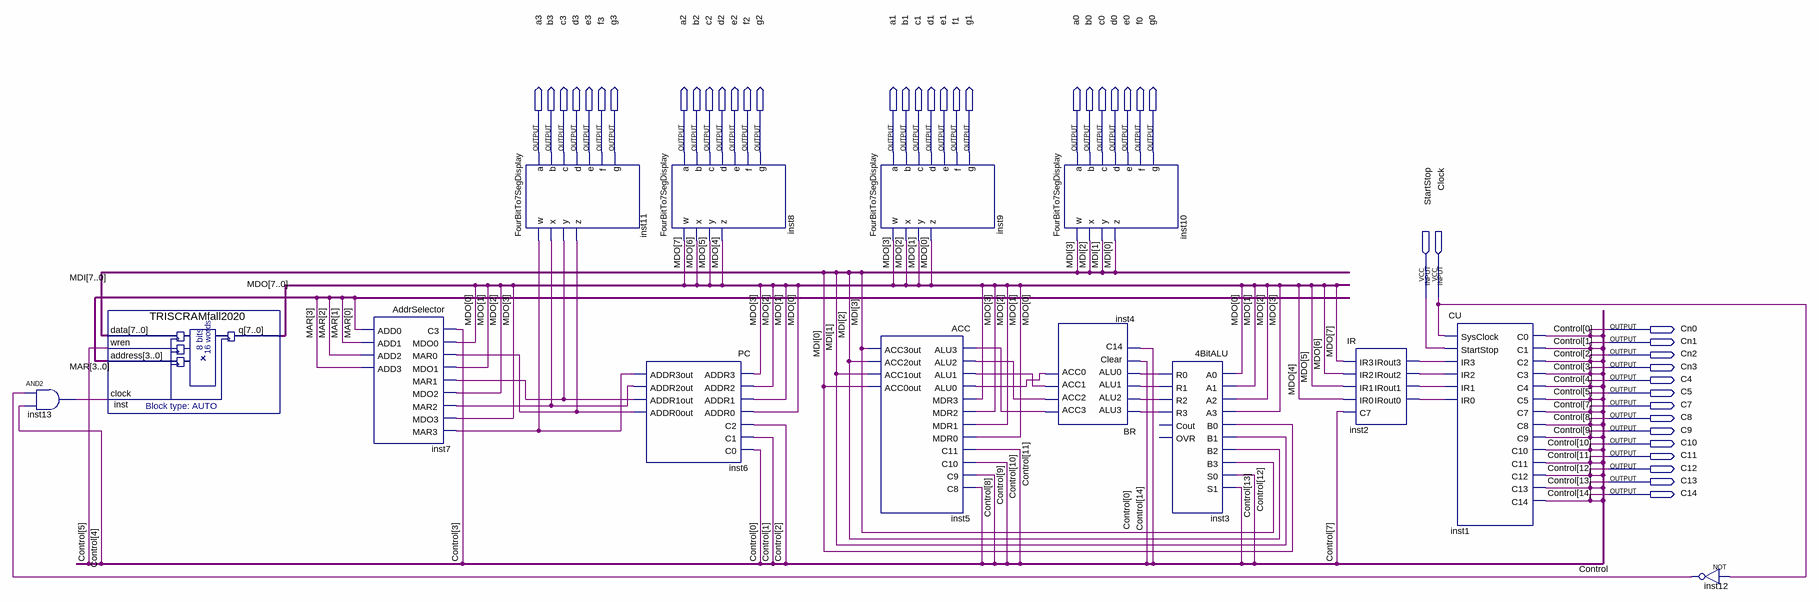
[diagram p0: schematic sheet]
// Quartus schematic CSE2441Project.bdf as structural Verilog: 14 symbols, 44 pins
module CSE2441Project (
  input  StartStop,
  input  Clock,
  output a3,
  output b3,
  output c3,
  output d3,
  output e3,
  output f3,
  output g3,
  output a2,
  output b2,
  output c2,
  output d2,
  output e2,
  output f2,
  output g2,
  output a1,
  output b1,
  output c1,
  output d1,
  output e1,
  output f1,
  output g1,
  output a0,
  output b0,
  output c0,
  output d0,
  output e0,
  output f0,
  output g0,
  output Cn0,
  output Cn1,
  output Cn2,
  output Cn3,
  output C4,
  output C5,
  output C7,
  output C8,
  output C9,
  output C10,
  output C11,
  output C12,
  output C13,
  output C14
);

  wire inst2_irout0, inst2_irout1, inst2_irout2, inst2_irout3, inst3_r0, inst3_r1, inst3_r2, inst3_r3,
       inst4_acc0, inst4_acc1, inst4_acc2, inst4_acc3, inst6_addr0out, inst6_addr1out, inst6_addr2out,
       inst6_addr3out, inst12_out, inst13_out;
  wire [3:0] MAR;
  wire [7:0] MDI, MDO;

  and inst13 (inst13_out, inst12_out, C4);
  TRISCRAMfall2020 inst (.data(MDI), .wren(C5), .address(MAR), .clock(inst13_out), .q(MDO));
  AddrSelector inst7 (
    .C3(Cn3), .MDO0(MDO[0]), .MAR0(inst6_addr0out), .MDO1(MDO[1]), .MAR1(inst6_addr1out), .MDO2(MDO[2]),
    .MAR2(inst6_addr2out), .MDO3(MDO[3]), .MAR3(inst6_addr3out), .ADD0(MAR[0]), .ADD1(MAR[1]), .ADD2(MAR[2]),
    .ADD3(MAR[3]));
  FourBitTo7SegDisplay inst11 (
    .w(inst6_addr3out), .x(inst6_addr2out), .y(inst6_addr1out), .z(inst6_addr0out), .a(a3), .b(b3), .c(c3),
    .d(d3), .e(e3), .f(f3), .g(g3));
  FourBitTo7SegDisplay inst8 (
    .w(MDO[7]), .x(MDO[6]), .y(MDO[5]), .z(MDO[4]), .a(a2), .b(b2), .c(c2), .d(d2), .e(e2), .f(f2), .g(g2));
  PC inst6 (
    .ADDR3(MDO[3]), .ADDR2(MDO[2]), .ADDR1(MDO[1]), .ADDR0(MDO[0]), .C2(Cn2), .C1(Cn1), .C0(Cn0),
    .ADDR3out(inst6_addr3out), .ADDR2out(inst6_addr2out), .ADDR1out(inst6_addr1out), .ADDR0out(inst6_addr0out));
  FourBitTo7SegDisplay inst9 (
    .w(MDO[3]), .x(MDO[2]), .y(MDO[1]), .z(MDO[0]), .a(a1), .b(b1), .c(c1), .d(d1), .e(e1), .f(f1), .g(g1));
  ACC inst5 (
    .ALU3(inst4_acc3), .ALU2(inst4_acc2), .ALU1(inst4_acc1), .ALU0(inst4_acc0), .MDR3(MDO[3]), .MDR2(MDO[2]),
    .MDR1(MDO[1]), .MDR0(MDO[0]), .C11(C11), .C10(C10), .C9(C9), .C8(C8), .ACC3out(MDI[3]), .ACC2out(MDI[2]),
    .ACC1out(MDI[1]), .ACC0out(MDI[0]));
  FourBitTo7SegDisplay inst10 (
    .w(MDI[3]), .x(MDI[2]), .y(MDI[1]), .z(MDI[0]), .a(a0), .b(b0), .c(c0), .d(d0), .e(e0), .f(f0), .g(g0));
  BR inst4 (
    .ALU3(inst3_r3), .ALU2(inst3_r2), .ALU1(inst3_r1), .ALU0(inst3_r0), .Clear(Cn0), .C14(C14),
    .ACC3(inst4_acc3), .ACC2(inst4_acc2), .ACC1(inst4_acc1), .ACC0(inst4_acc0));
  \4BitALU  inst3 (
    .A0(MDO[0]), .A1(MDO[1]), .A2(MDO[2]), .A3(MDO[3]), .B0(MDI[0]), .B1(MDI[1]), .B2(MDI[2]), .B3(MDI[3]),
    .S0(C12), .S1(C13), .R0(inst3_r0), .R1(inst3_r1), .R2(inst3_r2), .R3(inst3_r3));  // open: Cout, OVR
  IR inst2 (
    .IR3(MDO[7]), .IR2(MDO[6]), .IR1(MDO[5]), .IR0(MDO[4]), .C7(C7), .IRout3(inst2_irout3),
    .IRout2(inst2_irout2), .IRout1(inst2_irout1), .IRout0(inst2_irout0));
  CU inst1 (
    .SysClock(Clock), .StartStop(StartStop), .IR3(inst2_irout3), .IR2(inst2_irout2), .IR1(inst2_irout1),
    .IR0(inst2_irout0), .C0(Cn0), .C1(Cn1), .C2(Cn2), .C3(Cn3), .C4(C4), .C5(C5), .C7(C7), .C8(C8), .C9(C9),
    .C10(C10), .C11(C11), .C12(C12), .C13(C13), .C14(C14));
  not inst12 (inst12_out, Clock);

  // Other names for the same wires on the sheet: Control (some bits) = {C14, C13, C12, C11, C10, C9, C8, C7, C5, C4, Cn3, Cn2, Cn1, Cn0}
endmodule
